# EasyEDA schematic SCH_Survival-PC-3000_2026-08-28.json
TITLE: Survival PC 3000; REV: 1.0; Date: 2026-08-28; Sheet: 1/1; Drawn By: DanieleM; Company: Hack Club
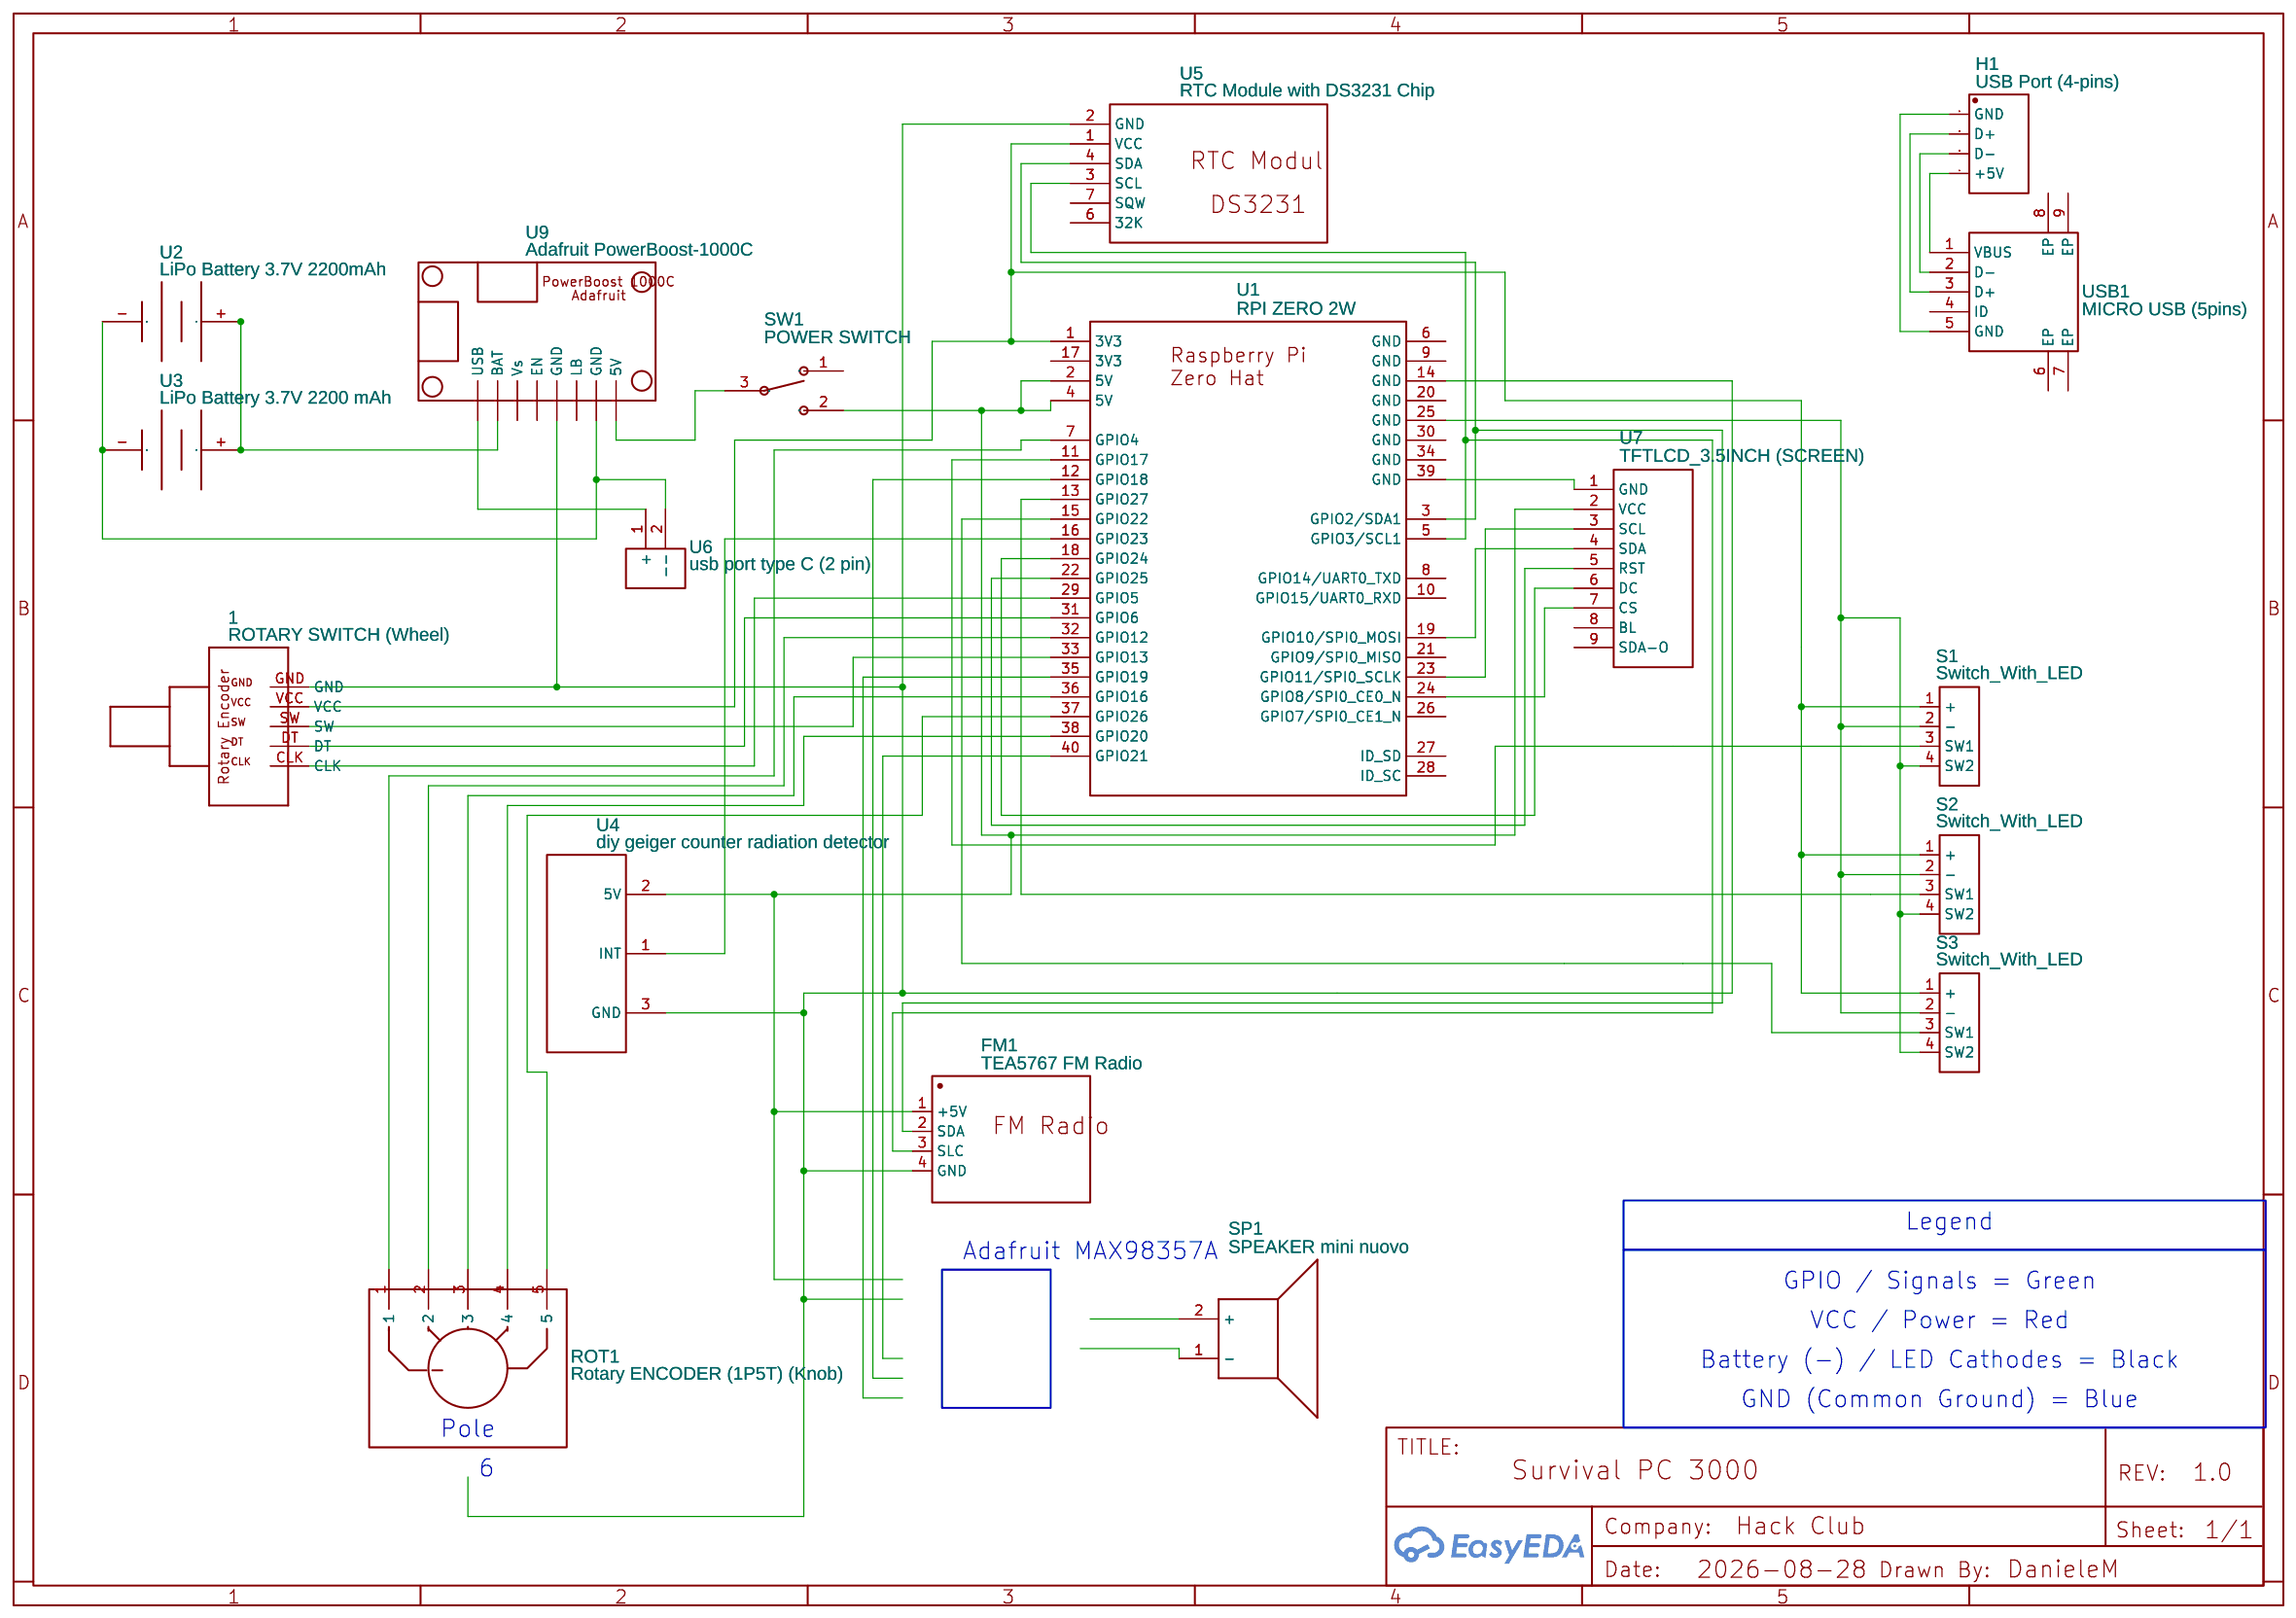
[diagram p0: schematic sheet]

## Parts
1  ROTARY SWITCH (Wheel)  [ROTARYENCODERF]
FM1  TEA5767 FM Radio  [TEA5767]
H1  USB Port (4-pins)  [USB-TYPE_A-4-PINS]
ROT1  Rotary ENCODER (1P5T) (Knob)  [ROTARY RS1010-24 1POLE 4POSITIONS]
S1  Switch_With_LED  [PB_SWITCH_WITH_LED_1A]
S2  Switch_With_LED  [PB_SWITCH_WITH_LED_1A]
S3  Switch_With_LED  [PB_SWITCH_WITH_LED_1A]
SP1  SPEAKER mini nuovo  [MINIATURE SPEAKER (RS PRO)]
SW1  POWER SWITCH  [SMT 8.7 X 3.0 MM MINI SLIDE SWITCH]
U1  RPI ZERO 2W  [RASPBERRY_PI_ZERO_HAT]
U2  LiPo Battery 3.7V 2200mAh
U3  LiPo Battery 3.7V 2200 mAh
U4  diy geiger counter radiation detector  [DIY GEIGER COUNTER RADIATION DETECTOR]
U5  RTC Module with DS3231 Chip  [DS3231-RTC-MODULE]
U6  usb port type C (2 pin)  [USB TYPE C 2 PIN]
U7  TFTLCD_3.5INCH (SCREEN)  [TFTLCD_3.5INCH_ST7796U]
U9  Adafruit PowerBoost-1000C  [ADAFRUIT POWERBOOST-1000C]
USB1  MICRO USB (5pins)  [MICROUSB-SMD-5PIN-#1]

## Library data of the parts
1 = ROTARYENCODER: Contributor: DrKrypton
FM1 = TEA5767 FM Radio: Manufacturer Part: Redon; Supplier Part: undefined; Supplier: LCSC; Contributor: navin2013p
H1 = USB-Type-A-4-pins: Manufacturer: Ckmtw; Manufacturer Part: 210S-1*4P L=11.6MMGold-plated black; Contributor: Dmitry Mazur; Supplier Part: C124378; JLCPCB Part Class: Extended Part
ROT1 = Rotary RS1010 5 PIN: Contributor: Jelle M.
S1-S3 = PB_Switch_With_LED: Contributor: p.youngseo0115
SP1 = SPEAKER mini nuovo: Contributor: sayer; Supplier: RS-Online; Supplier Part: 780-0719; link: https://docs.rs-online.com/ab5a/0900766b81582bb4.pdf
SW1 = SMT 8.7 X 3.0 MM MINI SLIDE SWITCH: Manufacturer: Würth Elektronik; Manufacturer Part: 450405020524; Supplier: Digi-Key; Supplier Part: 732-450405020524TR-ND; link: https://www.digikey.com/en/products/detail/würth-elektronik/450405020524/11627297; Contributor: jefreythompson
U1 = RPI ZERO 2W: Manufacturer: Raspberry Pi Foundation; Contributor: LucAce
U2 U3 = Tenergy Li-ion 18650 3.7V 2200mAh: Supplier: Parkers; link: https://power.tenergy.com/at-i-tenergy-li-ion-18650-3-6v-2200mah-rechargeable-battery-pack-w-pcb-1s1p-8-14wh-3-5a-rate/; Contributor: Zarzyos777
U4 = diy geiger counter radiation detector: Contributor: inesallouane
U5 = RTC Modul with DS3231 Chip: Contributor: fadhilahzulfakhri
U6 = usb type C 2 pin: Contributor: zikratiy
U7 = TFTLCD_3.5INCH_ST7796U_IO: Contributor: khs681225
U9 = Adafruit PowerBoost-1000C: Contributor: idunn
USB1 = MICROUSB-B-5PIN1: Supplier: LCSC; Supplier Part: C9900001196; Manufacturer Part: MicroUSB-5PIN; JLCPCB Part Class: Extended Part; link: https://wenku.baidu.com/view/86fe0d6b3968011ca200912d.html; Contributor: LCSC

## Nets
Net-(FM1-1): FM1.1(+5V) SW1.2 U1.2(5V) U1.4(5V) U4.2(5V) U7.2(VCC)
Net-(FM1-2): FM1.2(SDA) U1.3(GPIO2/SDA1) U5.4(SDA)
Net-(FM1-3): FM1.3(SLC) U1.5(GPIO3/SCL1) U5.3(SCL)
Net-(FM1-4): FM1.4(GND) U1.14(GND) U4.3(GND) U5.2(GND) U9.5(GND)
Net-(H1-1): H1.1(GND) USB1.5(GND)
Net-(H1-2): H1.2(D+) USB1.3(D+)
Net-(H1-3): H1.3(D-) USB1.2(D-)
Net-(H1-4): H1.4(+5V) USB1.1(VBUS)
Net-(ROT1-1): ROT1.1 U1.7(GPIO4)
Net-(ROT1-2): ROT1.2 U1.32(GPIO12)
Net-(ROT1-3): ROT1.3 U1.36(GPIO16)
Net-(ROT1-4): ROT1.4 U1.38(GPIO20)
Net-(ROT1-5): ROT1.5 U1.37(GPIO26)
Net-(S1-1): S1.1(+) S2.1(+) S3.1(+) U1.1(3V3) U5.1(VCC)
Net-(S1-2): S1.2(-) S1.4(SW2) S2.2(-) S2.4(SW2) S3.2(-) S3.4(SW2) U1.25(GND)
Net-(S1-3): S1.3(SW1) U1.11(GPIO17)
Net-(S2-3): S2.3(SW1) U1.13(GPIO27)
Net-(S3-3): S3.3(SW1) U1.15(GPIO22)
Net-(SW1-3): SW1.3 U9.8(5V)
Net-(U1-16): U1.16(GPIO23) U4.1(INT)
Net-(U1-18): U1.18(GPIO24) U7.6(DC)
Net-(U1-19): U1.19(GPIO10/SPI0_MOSI) U7.4(SDA)
Net-(U1-22): U1.22(GPIO25) U7.5(RST)
Net-(U1-23): U1.23(GPIO11/SPI0_SCLK) U7.3(SCL)
Net-(U1-24): U1.24(GPIO8/SPI0_CE0_N) U7.7(CS)
Net-(U1-39): U1.39(GND) U7.1(GND)
Net-(U2-+): U2.+(1) U3.+(1) U9.2(BAT)
Net-(U2--): U2.-(2) U3.-(2) U6.2(--) U9.7(GND)
Net-(U6-1): U6.1(+) U9.1(USB)

Not connected (* = marked no-connect by the designer): 1 CLK DT GND SW VCC; SP1 1(-) 2(+); SW1 1; U1 6(GND) 8(GPIO14/UART0_TXD) 9(GND) 10(GPIO15/UART0_RXD) 12(GPIO18) 17(3V3) 20(GND) 21(GPIO9/SPI0_MISO) 26(GPIO7/SPI0_CE1_N) 27(ID_SD) 28(ID_SC) 29(GPIO5) 30(GND) 31(GPIO6) 33(GPIO13) 34(GND) 35(GPIO19) 40(GPIO21); U5 6(32K) 7(SQW); U7 8(BL) 9(SDA-O); U9 3(Vs) 4(EN) 6(LB); USB1 4(ID) 6(EP) 7(EP) 8(EP) 9(EP)

## Notes on the sheet
- Legend
- Adafruit MAX98357A
- GPIO / Signals = Green
- VCC / Power = Red
- Battery (-) / LED Cathodes = Black
- GND (Common Ground) = Blue
- Pole
- 6
